# EAGLE design slot_imu (EAGLE 9.6.2)
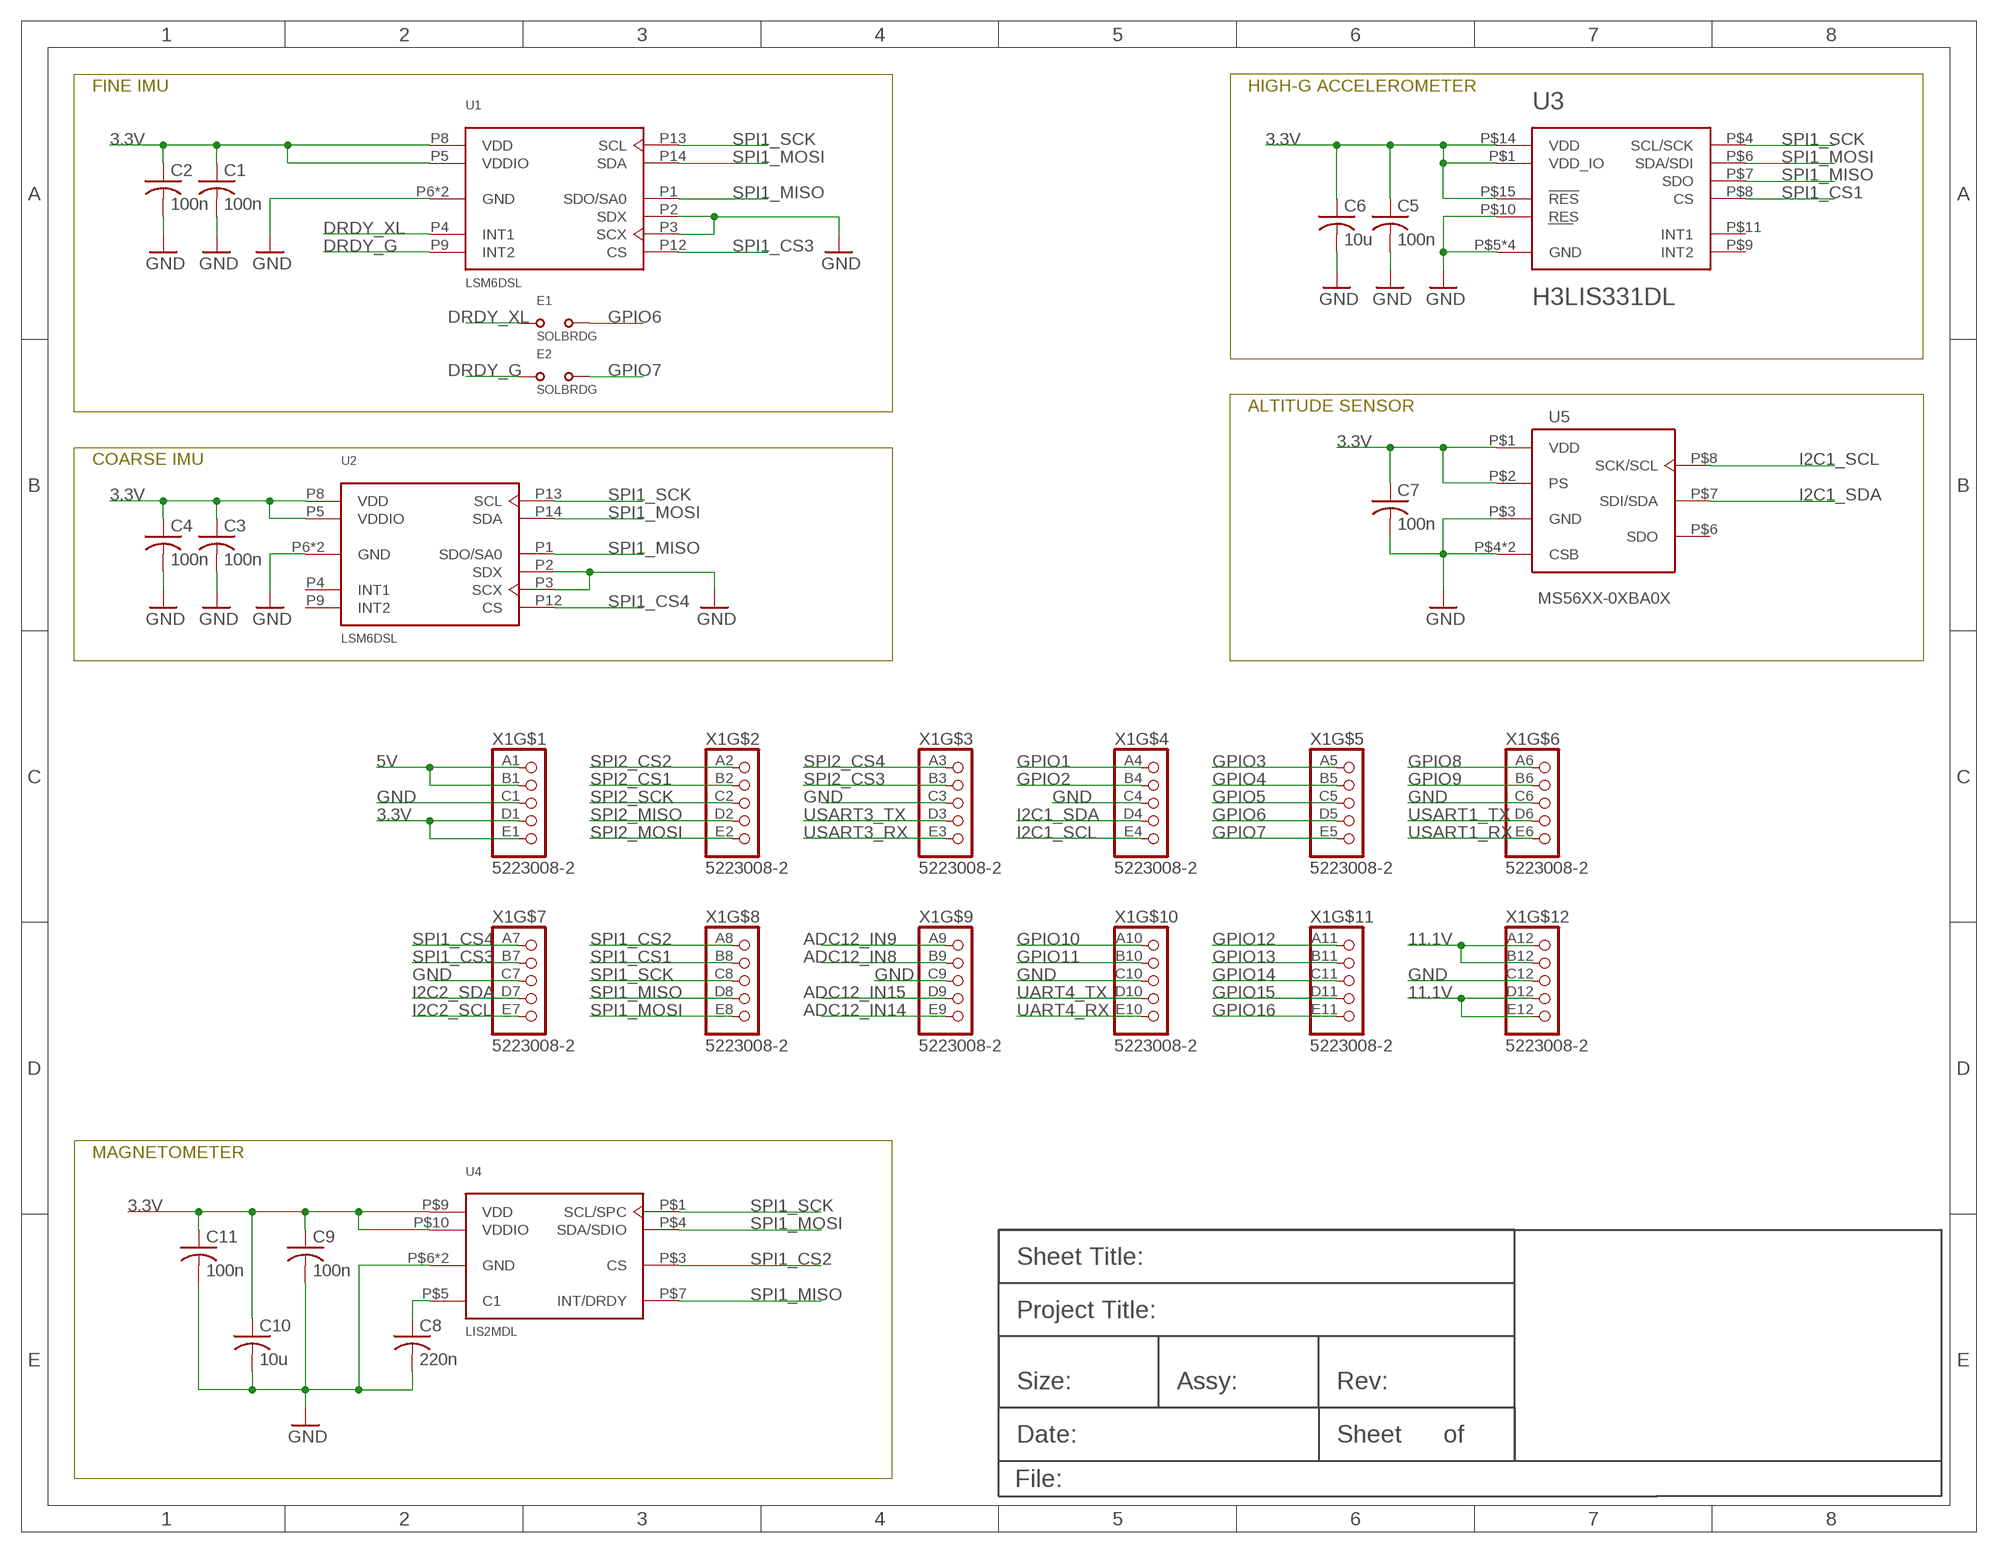
[diagram p0: schematic, sheet 1]

## Parts
C1  100n  C-USC0805  [C0805]
C2  100n  C-USC0805  [C0805]
C3  100n  C-USC0805  [C0805]
C4  100n  C-USC0805  [C0805]
C5  100n  C-USC0805  [C0805]
C6  10u  C-USC0805  [C0805]
C7  100n  C-USC0805  [C0805]
C8  220n  C-USC0805  [C0805]
C9  100n  C-USC0805  [C0805]
C10  10u  C-USC0805  [C0805]
C11  100n  C-USC0805  [C0805]
E1  SOLBRDG  [SOLBRDG]
E2  SOLBRDG  [SOLBRDG]
U1  LSM6DSL  [LGA-14]
U2  LSM6DSL  [LGA-14]
U3  H3LIS331DL  [TFLGA-16L]
U4  LIS2MDL  [LGA-12]
U5  MS56XX-0XBA0X  [MS56XX]
X1  5223008-2  [5223008-2]

## Nets
3.3V: C1.1 C2.1 C3.1 C4.1 C5.1 C6.1 C7.1 C9.1 C10.1 C11.1 U1.P5(VDDIO) U1.P8(VDD) U2.P5(VDDIO) U2.P8(VDD) U3.P$1(VDD_IO) U3.P$14(VDD) U3.P$15(!RES) U4.P$9(VDD) U4.P$10(VDDIO) U5.P$1(VDD) U5.P$2(PS) X1.D1 X1.E1
5V: X1.A1 X1.B1
11.1V: X1.A12 X1.B12 X1.D12 X1.E12
ADC12_IN8: X1.B9
ADC12_IN9: X1.A9
ADC12_IN14: X1.E9
ADC12_IN15: X1.D9
DRDY_G: E2.P$1 U1.P9(INT2)
DRDY_XL: E1.P$1 U1.P4(INT1)
GND: C1.2 C2.2 C3.2 C4.2 C5.2 C6.2 C7.2 C8.2 C9.2 C10.2 C11.2 U1.P2(SDX) U1.P3(SCX) U1.P6(GND) U1.P7(GND) U2.P2(SDX) U2.P3(SCX) U2.P6(GND) U2.P7(GND) U3.P$5(GND) U3.P$10(RES) U3.P$12(GND) U3.P$13(GND) U3.P$16(GND) U4.P$6(GND) U4.P$8(GND) U5.P$3(GND) U5.P$4(CSB) U5.P$5(CSB) X1.C1 X1.C3 X1.C4 X1.C6 X1.C7 X1.C9 X1.C10 X1.C12
GPIO1: X1.A4
GPIO2: X1.B4
GPIO3: X1.A5
GPIO4: X1.B5
GPIO5: X1.C5
GPIO6: E1.P$2 X1.D5
GPIO7: E2.P$2 X1.E5
GPIO8: X1.A6
GPIO9: X1.B6
GPIO10: X1.A10
GPIO11: X1.B10
GPIO12: X1.A11
GPIO13: X1.B11
GPIO14: X1.C11
GPIO15: X1.D11
GPIO16: X1.E11
I2C1_SCL: U5.P$8(SCK/SCL) X1.E4
I2C1_SDA: U5.P$7(SDI/SDA) X1.D4
I2C2_SCL: X1.E7
I2C2_SDA: X1.D7
N$1: C8.1 U4.P$5(C1)
SPI1_CS1: U3.P$8(CS) X1.B8
SPI1_CS2: U4.P$3(CS) X1.A8
SPI1_CS3: U1.P12(CS) X1.B7
SPI1_CS4: U2.P12(CS) X1.A7
SPI1_MISO: U1.P1(SDO/SA0) U2.P1(SDO/SA0) U3.P$7(SDO) U4.P$7(INT/DRDY) X1.D8
SPI1_MOSI: U1.P14(SDA) U2.P14(SDA) U3.P$6(SDA/SDI) U4.P$4(SDA/SDIO) X1.E8
SPI1_SCK: U1.P13(SCL) U2.P13(SCL) U3.P$4(SCL/SCK) U4.P$1(SCL/SPC) X1.C8
SPI2_CS1: X1.B2
SPI2_CS2: X1.A2
SPI2_CS3: X1.B3
SPI2_CS4: X1.A3
SPI2_MISO: X1.D2
SPI2_MOSI: X1.E2
SPI2_SCK: X1.C2
UART4_RX: X1.E10
UART4_TX: X1.D10
USART1_RX: X1.E6
USART1_TX: X1.D6
USART3_RX: X1.E3
USART3_TX: X1.D3
Unconnected: U2.P4(INT1) U2.P9(INT2) U3.P$9(INT2) U3.P$11(INT1) U5.P$6(SDO)

## Notes on the sheet
- FINE IMU | HIGH-G ACCELEROMETER
- ALTITUDE SENSOR
- COARSE IMU
- MAGNETOMETER

## Library data of the parts
C1-C11 = rcl:C-US: CAPACITOR, American symbol; SPICEPREFIX: C
E1 E2 = CPSS_CONNECTOR:SOLBRDG
U1 U2 = CPSS_SENSOR:LSM6DSL
U3 = CPSS_SENSOR:H3LIS331DL: ST Microelectronics High-g 3-axis accelerometer Features - Wide supply voltage, 2.16 V to 3.6 V - Low-voltage compatible IOs, 1.8 V - Ultra-low power consumption down to 10 μA in low-power mode - ±100g/±200g/±400g dynamically selectable full scales - I2C/SPI digital output interface - 16-bit data output - Sleep-to-wakeup function - 10000 g high-shock survivability - ECOPACK®, RoHS and “Green” compliant
U4 = CPSS_SENSOR:LIS2MDL: ST Microelectronics 3-Axis Magnetometer Features: - 3 magnetic field channels - ±50 gauss magnetic dynamic range - 16-bit data output - SPI/I2C serial interfaces - Analog supply voltage 1.71 V to 3.6 V - Selectable power mode/resolution - Single measurement mode - Programmable interrupt generator - Embedded self-test - Embedded temperature sensor - ECOPACK®, RoHS and “Green” compliant
U5 = CPSS_SENSOR:MS56XX-0XBA0X: TE Connnectivity MS5611-01BA03 Barometer
X1 = backplane:5223008-2

## Board
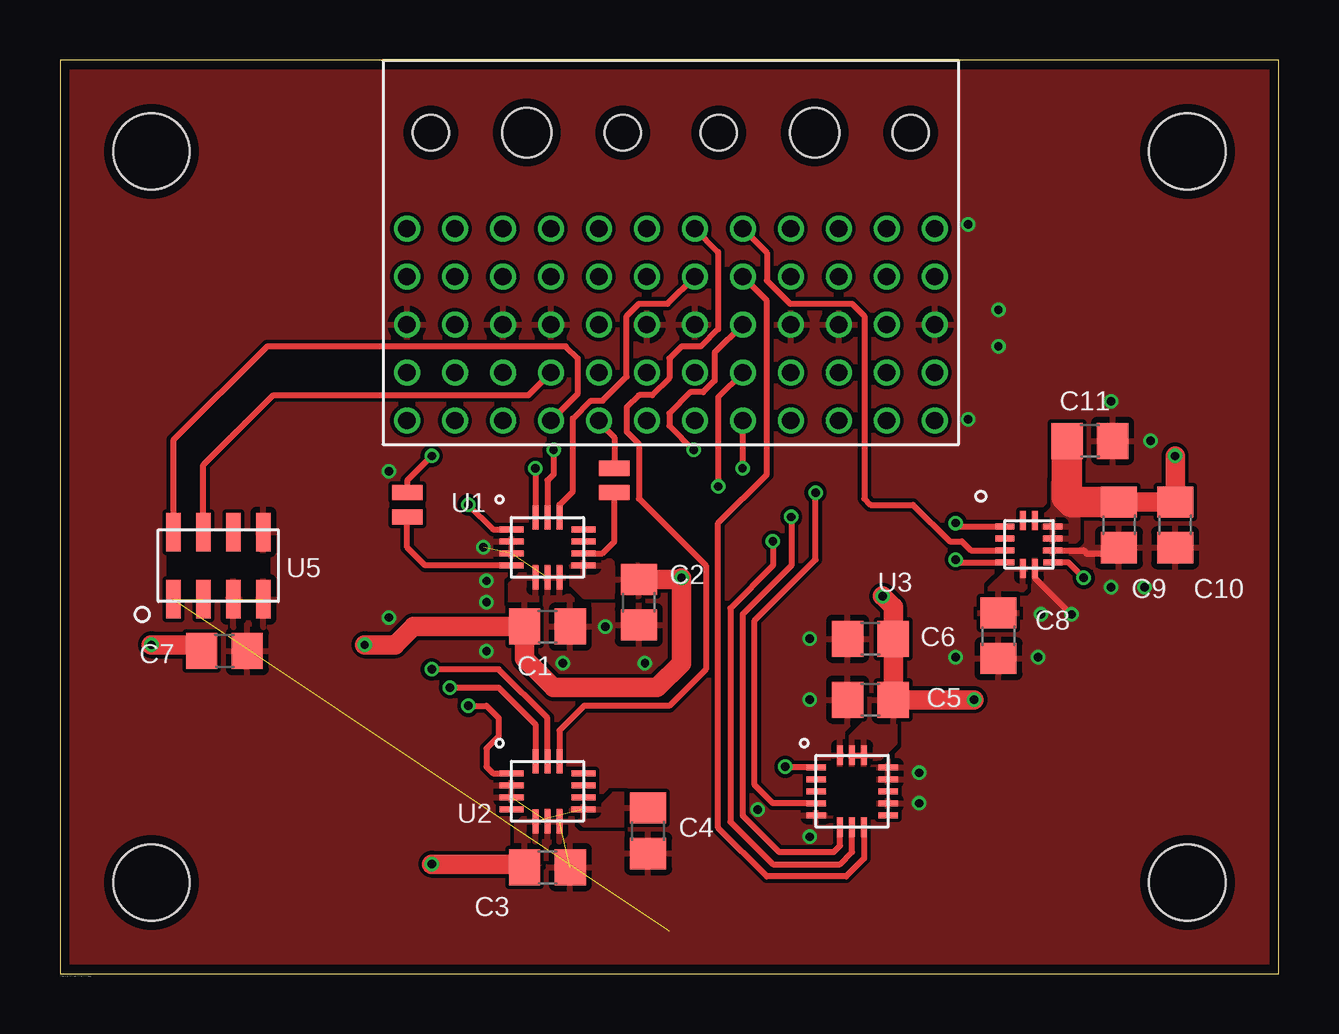
[diagram p1: board, top side]
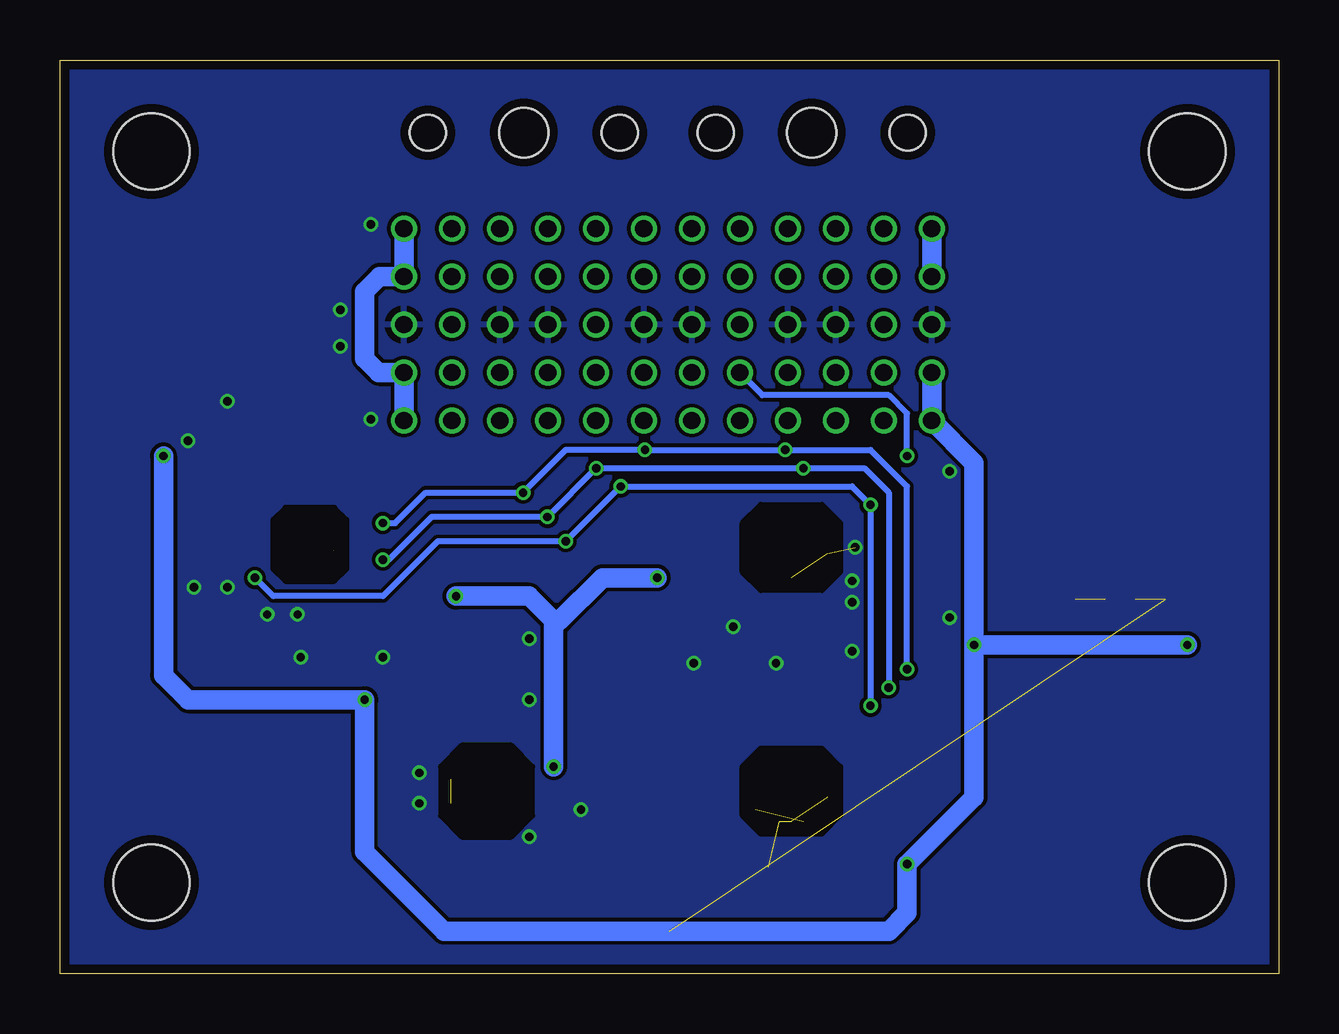
[diagram p2: board, bottom side, seen from below]

Size 50.8 x 38.1 mm. Coordinates in mm from the lower left corner, seen from the top.
Outline: 0,0 50.8,0 50.8,38.1 0,38.1 0,0
Copper layers (1*16): Top 0.035559375mm / dielectric 1.6mm / Bottom 0.035559375mm
Design rules "oshpark-2layer *": minimum track width 6mil, minimum drill 10mil, track to track 6mil, track to pad 6mil, pad to pad 6mil, via to via 6mil, smd to smd 6mil, copper to edge 15mil, drill to drill 6mil, minimum pad ring 5mil, minimum via ring 5mil, stop-mask expansion 2.5mil, vias tented up to drill 20mil, thermal gap 10mil
Holes 3.17 mm at 3.81,3.81 3.81,34.29 46.99,34.29 46.99,3.81
bRestrict: area 38.9,16.4 to 41.9,19.4; area 18.3,16 to 22.4,19.6; area 18.3,5.8 to 22.4,9.4; area 31.1,5.7 to 34.9,9.5

### Footprints (pad centres in the part's own frame; a part is rotated, then mirrored left to right if it is on the bottom)
C0805 = smd 1.3 x 1.5: 1 -0.95,0; 2 0.95,0
SOLBRDG = smd 1.27 x 0.635: P$1 0,-0.508; P$2 0,0.508
LGA-14 = smd 1 x 0.25: P1 -1.5,0.75; P2 -1.5,0.25; P3 -1.5,-0.25; P4 -1.5,-0.75; P8 1.5,-0.75; P9 1.5,-0.25; P10 1.5,0.25; P11 1.5,0.75 | smd 0.25 x 1: P5 -0.5,-1.25; P6 0,-1.25; P7 0.5,-1.25; P12 0.5,1.25; P13 0,1.25; P14 -0.5,1.25
TFLGA-16L = smd 0.8 x 0.25: P$1 -1.5,1; P$2 -1.5,0.5; P$3 -1.5,0; P$4 -1.5,-0.5; P$5 -1.5,-1; P$9 1.5,-1; P$10 1.5,-0.5; P$11 1.5,0; P$12 1.5,0.5; P$13 1.5,1 | smd 0.25 x 0.8: P$6 -0.5,-1.5; P$7 0,-1.5; P$8 0.5,-1.5; P$14 0.5,1.5; P$15 0,1.5; P$16 -0.5,1.5
LGA-12 = smd 0.8 x 0.25: P$1 -1,0.75; P$2 -1,0.25; P$3 -1,-0.25; P$4 -1,-0.75; P$7 1,-0.75; P$8 1,-0.25; P$9 1,0.25; P$10 1,0.75 | smd 0.25 x 0.8: P$5 -0.25,-1; P$6 0.25,-1; P$11 0.25,1; P$12 -0.25,1
MS56XX = smd 1.6 x 0.6: P$1 -1.4,1.875; P$2 -1.4,0.625; P$3 -1.4,-0.625; P$4 -1.4,-1.875; P$5 1.4,-1.875; P$6 1.4,-0.625; P$7 1.4,0.625; P$8 1.4,1.875
5223008-2 = drill 0.725: A1 -11,4; A2 -9,4; A3 -7,4; A4 -5,4; A5 -3,4; A6 -1,4; A7 1,4; A8 3,4; A9 5,4; A10 7,4; A11 9,4; A12 11,4; B1 -11,2; B2 -9,2; B3 -7,2; B4 -5,2; B5 -3,2; B6 -1,2; B7 1,2; B8 3,2; B9 5,2; B10 7,2; B11 9,2; B12 11,2; C1 -11,0; C2 -9,0; C3 -7,0; C4 -5,0; C5 -3,0; C6 -1,0; C7 1,0; C8 3,0; C9 5,0; C10 7,0; C11 9,0; C12 11,0; D1 -11,-2; D2 -9,-2; D3 -7,-2; D4 -5,-2; D5 -3,-2; D6 -1,-2; D7 1,-2; D8 3,-2; D9 5,-2; D10 7,-2; D11 9,-2; D12 11,-2; E1 -11,-4; E2 -9,-4; E3 -7,-4; E4 -5,-4; E5 -3,-4; E6 -1,-4; E7 1,-4; E8 3,-4; E9 5,-4; E10 7,-4; E11 9,-4; E12 11,-4 | hole 2.05: -6,8; 6,8 | hole 1.5: -10,8; -2,8; 10,8; 2,8

### Placement (x,y rotation side)
C1  20.32,14.48 0 top
C2  24.13,15.49 270 top
C3  20.32,4.45 0 top
C4  24.51,5.97 270 top
C5  33.78,11.43 180 top
C6  33.78,13.97 180 top
C7  6.86,13.46 0 top
C8  39.12,14.1 270 top
C9  44.15,18.72 270 top
C10  46.48,18.72 270 top
C11  42.93,22.23 0 top
E1  14.48,19.56 0 top
E2  23.11,20.57 0 top
U1  20.32,17.78 0 top
U2  20.32,7.62 0 top
U3  33.02,7.62 0 top
U4  40.39,17.91 0 top
U5  6.6,17.02 90 top
X1  25.46,27.07 0 top

### Tracks (layer width: path | path; a pad name or v marks a point on that pad's centre or on a via)
3.3V  (via drill 0.35)  (3 unrouted)
  Top 0.254: U3.P$1 30.24,8.62 v30.23,8.64 | U3.P$15 U3.P$14
  Top 0.813: v3.81,13.72 5.65,13.72 C7.1 | v12.7,13.72 13.97,13.72 14.73,14.48 C1.1 19.37,13.14 20.57,11.94 24.89,11.94 25.91,12.95 v25.91,16.51 25.84,16.44 C2.1 | v15.49,4.57 19.24,4.57 C3.1 | v38.1,11.43 C5.1 C6.1 34.73,15.31 v34.29,15.75 | C9.1 C10.1 v46.48,21.59
  Top 1.27: C11.1 41.98,19.87 42.18,19.67 C9.1
  Bottom 0.813: X1.D1 X1.E1 12.7,21.31 v12.7,13.72 | v3.81,13.72 v12.7,13.72 | v12.7,13.72 12.7,7.37 v15.49,4.57 15.49,2.54 16.26,1.78 25.4,1.78 34.8,1.78 38.1,5.08 v38.1,11.43 45.47,11.43 46.48,12.45 v46.48,21.59 | v25.91,16.51 28.19,16.51 29.97,14.73 | 29.97,14.73 30.23,14.48 v30.23,8.64 | 29.97,14.73 30.23,14.73 31.24,15.75 v34.29,15.75
  pour Top: 32.94,8.64 33.78,8.64 34.8,9.65 34.8,11.43 33.53,11.43 33.53,10.41 32.94,9.83
  pour Top: 21.34,17.02 21.34,16.26 21.84,15.75 24.13,15.75 24.13,17.02 23.11,17.02 22.86,17.27 21.59,17.27
  pour Top: 19.84,17.02 19.84,14.48 18.8,14.48 18.8,16.26 19.56,17.02
  pour Top: 21.34,6.99 22.61,6.99 23.11,7.49 24.13,7.49 24.13,6.22 21.84,6.22 21.34,6.73
  pour Top: 19.3,6.48 20.07,6.48 20.07,4.7 19.81,4.45 19.05,4.45 19.05,6.22
  pour Top: 40.89,17.91 42.16,17.91 42.42,18.16 42.42,20.45 41.4,20.45 41.4,19.43 40.89,18.92
5V
  Bottom 0.813: X1.A1 X1.B1
11.1V
  Bottom 0.813: X1.A12 X1.B12 37.48,29.07 38.1,28.45 38.1,25.65 37.52,25.07 X1.D12 X1.E12
DRDY_G
  Top 0.254: U1.P9 22.61,17.53 23.11,18.03 E2.P$1
DRDY_XL
  Top 0.254: U1.P4 15.23,17.03 14.48,17.78 E1.P$1
GND  (via drill 0.35)  (7 unrouted)
  Top 0.254: U4.P$8 42.67,17.66 42.8,17.53 43.9,17.53 C9.2 | U4.P$6 40.64,16.51 v42.16,14.99
  other vias: 22.73,14.48 17.65,17.78 17.78,16.38 17.78,15.49 13.72,14.86 13.72,20.95 17.78,13.46 20.95,12.95 24.38,12.95 31.24,13.97 31.24,11.43 29.08,6.86 31.24,5.71 35.81,7.11 35.81,8.38 45.47,22.23 43.81,23.88 43.81,16.13 45.21,16.13 40.89,14.99 40.77,13.21 37.34,13.21 39.12,26.16 39.12,27.69 37.85,31.24 37.85,23.11
  pour Top (rank 2): 0,0 50.8,0 50.8,38.1 0,38.1
  pour Bottom (rank 2): 0,0 50.8,0 50.8,38.1 0,38.1
GPIO6  (via drill 0.35)
  Top 0.254: E1.P$2 14.48,20.57 v15.49,21.59
  Bottom 0.254: v15.49,21.59 15.49,23.37 16.26,24.13 21.52,24.13 X1.D5
GPIO7
  Top 0.254: X1.E5 22.46,23 23.11,22.35 E2.P$2
I2C1_SCL
  Top 0.254: X1.E4 21.59,24.2 21.59,25.65 21.08,26.16 8.64,26.16 4.73,22.25 U5.P$8
I2C1_SDA
  Top 0.254: U5.P$7 5.98,21.22 8.89,24.13 19.52,24.13 X1.D4
N$1
  pour Top: 40.39,17.14 39.88,17.14 38.35,15.62 38.35,14.86 39.88,14.86 39.88,15.8 40.39,16.31
SPI1_CS1
  Top 0.254: U3.P$8 33.52,4.82 32.77,4.06 29.46,4.06 27.43,6.1 27.43,18.8 29.46,20.83 29.46,28.07 X1.B8
SPI1_CS2  (1 unrouted)
  Top 0.254: X1.A8 29.46,30.07 29.46,28.9 30.43,27.94 33.02,27.94 33.53,27.43 33.53,19.81 33.78,19.56 35.56,19.56 37.08,18.03 37.59,18.03 37.97,17.66 U4.P$3
SPI1_CS3
  Top 0.254: U1.P12 20.82,19.55 21.39,20.11 21.39,23.16 22.12,23.89 22.62,23.89 23.62,24.89 23.62,27.43 24.13,27.94 25.33,27.94 X1.B7
SPI1_CS4
  Top 0.254: X1.A7 27.43,30.1 27.43,26.88 26.72,26.16 25.91,26.16 25.4,25.65 25.4,24.84 24.69,24.13 24.13,24.13 23.62,23.62 23.62,22.61 24.13,22.1 24.13,19.81 26.92,17.02 26.92,12.7 25.4,11.18 21.84,11.18 20.82,10.15 U2.P12
SPI1_MISO  (via drill 0.35)
  Top 0.254: X1.D8 27.43,24.04 v27.43,20.32 | v17.02,19.56 18.05,18.53 U1.P1 | v42.67,16.51 42.02,17.16 U4.P$7 | v29.72,18.03 29.72,17.02 27.94,15.24 27.94,6.35 29.72,4.57 32.51,4.57 33.02,5.08 U3.P$7 | v17.02,11.18 17.78,11.18 18.29,10.67 18.29,9.91 17.78,9.4 17.78,8.64 18.05,8.37 U2.P1
  Bottom 0.254: v42.67,16.51 41.91,15.75 37.34,15.75 35.05,18.03 v29.72,18.03 v27.43,20.32 17.78,20.32 v17.02,19.56 v17.02,11.18
SPI1_MOSI  (via drill 0.35)
  Top 0.254: X1.E8 28.45,23.06 v28.45,21.08 | v19.81,21.08 v19.82,21.07 U1.P14 | v37.34,17.27 37.45,17.16 U4.P$4 | v30.48,19.05 30.48,17.02 28.45,14.99 28.45,6.6 29.97,5.08 32.26,5.08 32.52,5.34 U3.P$6 | v16.26,11.94 18.29,11.94 19.82,10.41 U2.P14
  Bottom 0.254: v37.34,17.27 37.08,17.27 35.31,19.05 v30.48,19.05 v28.45,21.08 v19.81,21.08 17.27,21.08 16.26,20.07 v16.26,11.94
SPI1_SCK  (via drill 0.35)
  Top 0.254: X1.C8 27.29,25.89 27.29,24.73 26.8,24.25 26.28,24.25 25.4,23.37 25.4,22.86 v26.42,21.84 | v20.57,21.84 20.57,20.83 20.32,20.57 U1.P13 | v37.34,18.8 37.48,18.66 U4.P$1 | U3.P$4 29.71,7.12 28.96,7.87 28.96,14.73 31.5,17.27 v31.5,20.07 | U2.P13 20.32,10.67 18.29,12.7 v15.49,12.7
  Bottom 0.254: v37.34,18.8 36.83,18.8 35.56,20.07 v31.5,20.07 29.72,21.84 v26.42,21.84 v20.57,21.84 17.02,21.84 15.49,20.32 v15.49,12.7

### Text on the board
tPlace: C:/Users/patri/Pictures/CPSSLOGO.bmp